# Altium project stm2f4discovery_K.PrjPcb
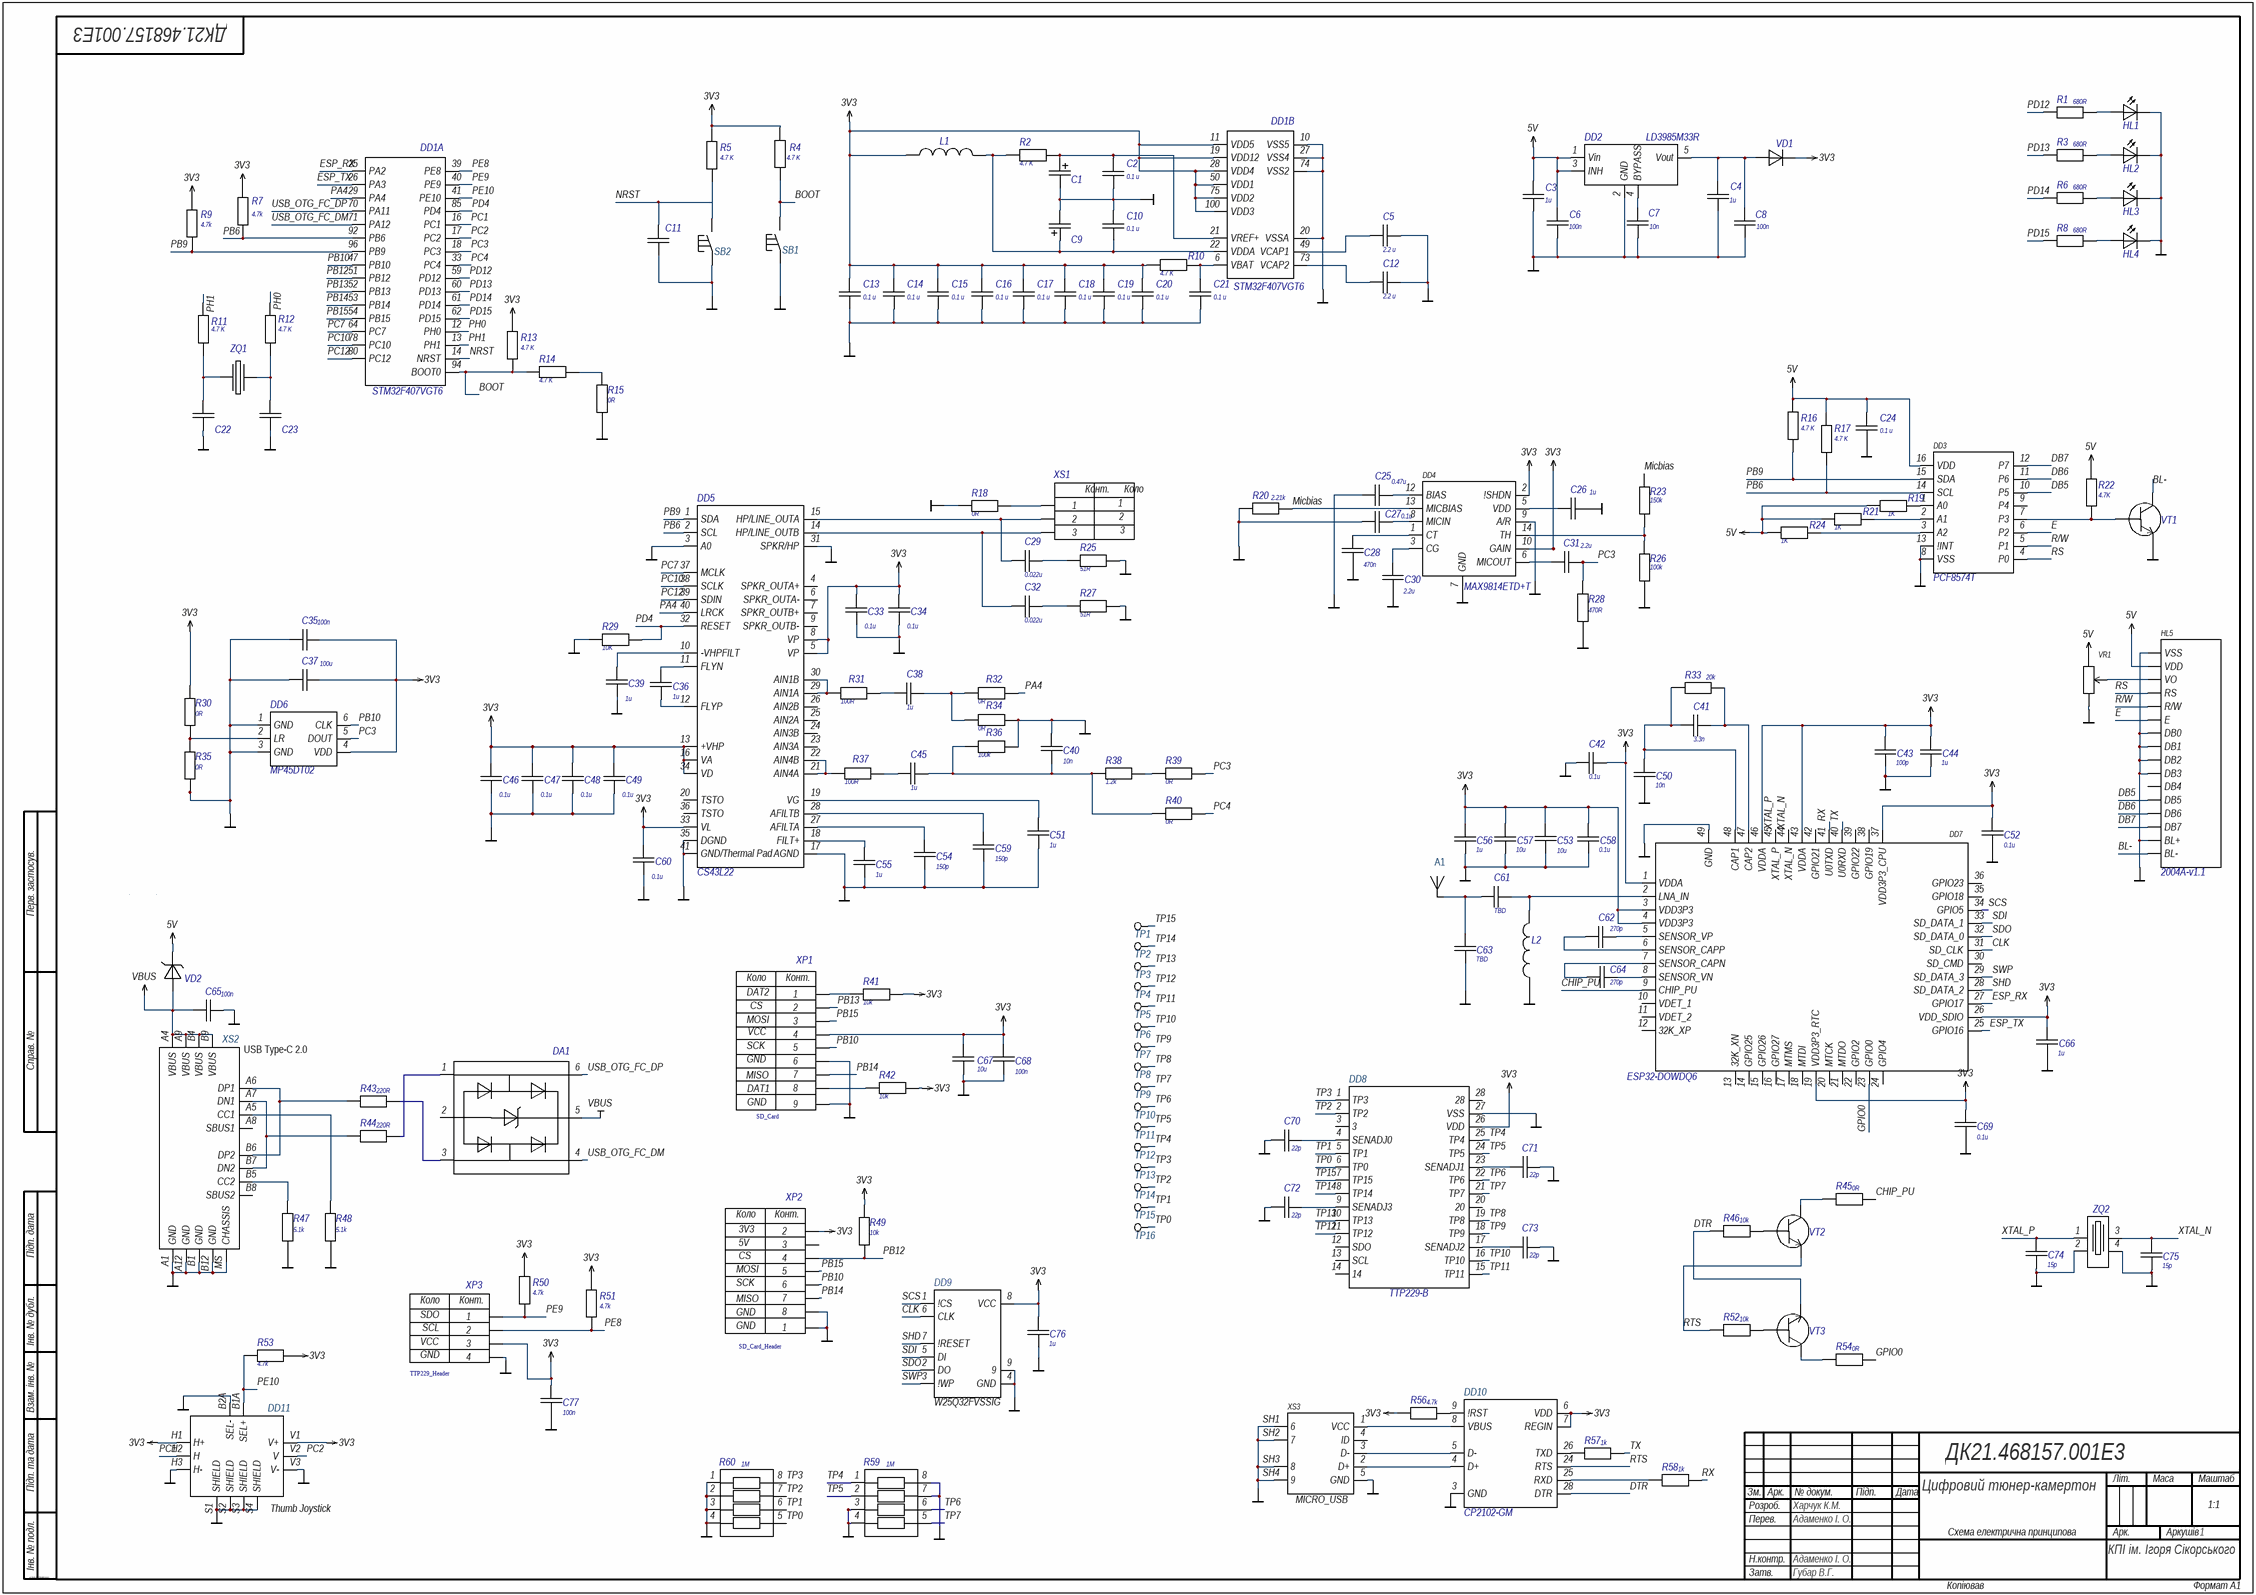
[diagram p0: ALL.SchDoc]
Вид_документа_SCH: Схема електрична принципова; Код_документа_SCH: Е3; Наименование: Цифровий тюнер-камертон; Наименование1: Цифровий тюнер-камертон; Наименование_PCB: Цифровий тюнер-камертон; Номер_документа_изменение: 1; Обозначение: ДК21.468157.001; Обозначение_PCB: ДК21.468157.001; Обозначение_Код: ДК21.468157.001Е3; Проект: ДК21.468157.001; Раздел: 1; Раздел_SCH: 1; Формат_PCB: А1; п_Н_контр: Адаменко І. О.; п_Н_контр_Р: Адаменко І. О.; п_Пров: Адаменко І. О.; п_Пров_Р: Адаменко І. О.; п_Разраб: Харчук К.М.; п_Разраб_Р: Харчук К.М.; п_Утв: Губар В.Г.; п_Утв_Р: Губар В.Г.
1 sheet, 188 parts. Net scope: global (net labels, ports and power ports of the same name join across sheets).
Board file: all.PcbDoc

## Sheet ALL.SchDoc
size 840 x 594 mm; Address1: L3, 12a Rodborough Rd; Address2: Frenchs Forest; Address3: NSW; Address4: Australia 2086; SheetTotal: 1

### Parts
A1  Antenna-1-Pin  [PCB_ANT]  (value not drawn)  (net tie)
C1  (no value)  [C_tantal]
C2  value 0.1 u  [C_0603]
C3  value 1u  [C_0603]
C4  value 1u  [C_0603]
C5  value 2.2 u  [C_0603]
C6  value 100n  [C_0603]
C7  value 10n  [C_0603]
C8  value 100n  [C_0603]
C9  (no value)  [C_tantal]
C10  value 0.1 u  [C_0603]
C11  (no value)  [C_0201]
C12  value 2.2 u  [C_0603]
C13  value 0.1 u  [C_0603]
C14  value 0.1 u  [C_0603]
C15  value 0.1 u  [C_0603]
C16  value 0.1 u  [C_0603]
C17  value 0.1 u  [C_0603]
C18  value 0.1 u  [C_0603]
C19  value 0.1 u  [C_0603]
C20  value 0.1 u  [C_0603]
C21  value 0.1 u  [C_0603]
C22  (no value)  [C_0603]
C23  (no value)  [C_0603]
C24  value 0.1 u  [C_0603]
C25  value 0.47u  [C_0603]
C26  value 1u  [C_0603]
C27  value 0.1u  [C_0603]
C28  value 470n  [C_0603]
C29  value 0.022u  [C_0603]
C30  value 2.2u  [C_0603]
C31  value 2.2u  [C_0603]
C32  value 0.022u  [C_0603]
C33  value 0.1u  [C_0603]
C34  value 0.1u  [C_0603]
C35  value 100n  [C_0603]
C36  value 1u  [C_0603]
C37  value 100u  [C_0603]
C38  value 1u  [C_0603]
C39  value 1u  [C_0603]
C40  value 10n  [C_0603]
C41  value 3.3n  [C_0603]
C42  value 0.1u  [C_0603]
C43  value 100p  [C_0603]
C44  value 1u  [C_0603]
C45  value 1u  [C_0603]
C46  value 0.1u  [C_0603]
C47  value 0.1u  [C_0603]
C48  value 0.1u  [C_0603]
C49  value 0.1u  [C_0603]
C50  value 10n  [C_0603]
C51  value 1u  [C_0603]
C52  value 0.1u  [C_0603]
C53  value 10u  [C_0603]
C54  value 150p  [C_0603]
C55  value 1u  [C_0603]
C56  value 1u  [C_0603]
C57  value 10u  [C_0603]
C58  value 0.1u  [C_0603]
C59  value 150p  [C_0603]
C60  value 0.1u  [C_0603]
C61  value TBD  [C_0603]
C62  value 270p  [C_0603]
C63  value TBD  [C_0603]
C64  value 270p  [C_0603]
C65  value 100n  [C_0603]
C66  value 1u  [C_0603]
C67  value 10u  [C_0603]
C68  value 100n  [C_0603]
C69  value 0.1u  [C_0603]
C70  value 22p  [C_0603]
C71  value 22p  [C_0603]
C72  value 22p  [C_0603]
C73  value 22p  [C_0603]
C74  value 15p  [C_0603]
C75  value 15p  [C_0603]
C76  value 1u  [C_0603]
C77  value 100n  [C_0603]
DA1  (no value)  [SOT-23-6L]
DD1  (no value)  [STM32F407VGT6]  (parts A,B of 2)
DD2  (no value)  [LD3985M33R]
DD3  Name: PCF8574T  [PCF8574TS]  (hidden comment: PCF8574T NXP USA Inc.)
DD4  Name: MAX9814ETD+T  [MAX9814]  (hidden comment: MAX9814ETD+T Analog Devices Inc./Maxim Integrated)
DD5  (no value)  [CS43L22]
DD6  (no value)  [MP45DT02]
DD7  ESP32-DOWDQ6 *  [ESP]  (value not drawn)
DD8  CP2102-GM  [28-SSOP]  (value not drawn)
DD9  W25Q32FVSSIG  [W25QxxxJVEIQ-127P800X80_MED]
DD10  CP2102-GM  [QFN-28_5x5mm]
DD11  Thumb Joystick  [XDCR_COM-09032]
HL1  (no value)  [LED]
HL2  (no value)  [LED]
HL3  (no value)  [LED]
HL4  (no value)  [LED]
HL5  Name: 2004A-v1.1  [lcd]  (hidden comment: LCD)
L1  (no value)  [INDUCTION]
L2  (no value)  [FB0603]
R1  value 680R  [R0_0603]  (hidden comment: 0603 0 В 680R 1% Keystone Electronics)
R2  value 4.7 K  [R0_0603]  (hidden comment: 0603 В 4.7 K 1% Keystone Electronics)
R3  value 680R  [R0_0603]  (hidden comment: 0603 0 В 680R 1% Keystone Electronics)
R4  value 4.7 K  [R0_0603]  (hidden comment: 0603 В 4.7 K 1% Keystone Electronics)
R5  value 4.7 K  [R0_0603]  (hidden comment: 0603 В 4.7 K 1% Keystone Electronics)
R6  value 680R  [R0_0603]  (hidden comment: 0603 0 В 680R 1% Keystone Electronics)
R7  value 4.7k  [R0_0603]  (hidden comment: 0603 0 В 4.7k 1% Keystone Electronics)
R8  value 680R  [R0_0603]  (hidden comment: 0603 0 В 680R 1% Keystone Electronics)
R9  value 4.7k  [R0_0603]  (hidden comment: 0603 0 В 4.7k 1% Keystone Electronics)
R10  value 4.7 K  [R0_0603]  (hidden comment: 0603 В 4.7 K 1% Keystone Electronics)
R11  value 4.7 K  [R0_0603]  (hidden comment: 0603 В 4.7 K 1% Keystone Electronics)
R12  value 4.7 K  [R0_0603]  (hidden comment: 0603 В 4.7 K 1% Keystone Electronics)
R13  value 4.7 K  [R0_0603]  (hidden comment: 0603 В 4.7 K 1% Keystone Electronics)
R14  value 4.7 K  [R0_0603]  (hidden comment: 0603 В 4.7 K 1% Keystone Electronics)
R15  value 0R  [R0_0603]  (hidden comment: 0603 В 0R 1% Keystone Electronics)
R16  value 4.7 K  [R0_0603]  (hidden comment: 0603 В 4.7 K 1% Keystone Electronics)
R17  value 4.7 K  [R0_0603]  (hidden comment: 0603 В 4.7 K 1% Keystone Electronics)
R18  value 0R  [R0_0603]  (hidden comment: 0603 В 0R 1% Keystone Electronics)
R19  value 1K  [R0_0603]  (hidden comment: 0603 В 1K 1% Keystone Electronics)
R20  value 2.21k  [R0_0603]  (hidden comment: 0603 0 В 2.21k 1% Keystone Electronics)
R21  value 1K  [R0_0603]  (hidden comment: 0603 В 1K 1% Keystone Electronics)
R22  value 4.7K  [R0_0603]  (hidden comment: 0603 В 4.7K 1% Keystone Electronics)
R23  value 150k  [R0_0603]  (hidden comment: 0603 0 В 150k 1% Keystone Electronics)
R24  value 1K  [R0_0603]  (hidden comment: 0603 В 1K 1% Keystone Electronics)
R25  value 51R  [R0_0603]  (hidden comment: 0603 В 51R 1% Keystone Electronics)
R26  value 100k  [R0_0603]  (hidden comment: 0603 0 В 100k 1% Keystone Electronics)
R27  value 51R  [R0_0603]  (hidden comment: 0603 В 51R 1% Keystone Electronics)
R28  value 470R  [R0_0603]  (hidden comment: 0603 0 В 470R 1% Keystone Electronics)
R29  value 10K  [R0_0603]  (hidden comment: 0603 В 10K 1% Keystone Electronics)
R30  value 0R  [R0_0603]  (hidden comment: 0603 В 0R 1% Keystone Electronics)
R31  value 100R  [R0_0603]  (hidden comment: 0603 В 100R 1% Keystone Electronics)
R32  value 0R  [R0_0603]  (hidden comment: 0603 В 0R 1% Keystone Electronics)
R33  value 20k  [R0_0603]  (hidden comment: 0603 0 В 20k 1% Keystone Electronics)
R34  value 0R  [R0_0603]  (hidden comment: 0603 В 0R 1% Keystone Electronics)
R35  value 0R  [R0_0603]  (hidden comment: 0603 В 0R 1% Keystone Electronics)
R36  value 100k  [R0_0603]  (hidden comment: 0603 В 100k 1% Keystone Electronics)
R37  value 100R  [R0_0603]  (hidden comment: 0603 В 100R 1% Keystone Electronics)
R38  value 1.2k  [R0_0603]  (hidden comment: 0603 В 1.2k 1% Keystone Electronics)
R39  value 0R  [R0_0603]  (hidden comment: 0603 В 0R 1% Keystone Electronics)
R40  value 0R  [R0_0603]  (hidden comment: 0603 В 0R 1% Keystone Electronics)
R41  value 10k  [R0_0603]  (hidden comment: 0603 0 В 10k 1% Keystone Electronics)
R42  value 10k  [R0_0603]  (hidden comment: 0603 0 В 10k 1% Keystone Electronics)
R43  value 220R  [R0_0603]  (hidden comment: 0603 0 В 220R 1% Keystone Electronics)
R44  value 220R  [R0_0603]  (hidden comment: 0603 0 В 220R 1% Keystone Electronics)
R45  value 0R  [R0_0603]  (hidden comment: 0603 0 В 0R 1% Keystone Electronics)
R46  value 10k  [R0_0603]  (hidden comment: 0603 0 В 10k 1% Keystone Electronics)
R47  value 5.1k  [R0_0603]  (hidden comment: 0603 0 В 5.1k 1% Keystone Electronics)
R48  value 5.1k  [R0_0603]  (hidden comment: 0603 0 В 5.1k 1% Keystone Electronics)
R49  value 10k  [R0_0603]  (hidden comment: 0603 0 В 10k 1% Keystone Electronics)
R50  value 4.7k  [R0_0603]  (hidden comment: 0603 0 В 4.7k 1% Keystone Electronics)
R51  value 4.7k  [R0_0603]  (hidden comment: 0603 0 В 4.7k 1% Keystone Electronics)
R52  value 10k  [R0_0603]  (hidden comment: 0603 0 В 10k 1% Keystone Electronics)
R53  value 4.7k  [R0_0603]  (hidden comment: 0603 0 В 4.7k 1% Keystone Electronics)
R54  value 0R  [R0_0603]  (hidden comment: 0603 0 В 0R 1% Keystone Electronics)
R56  value 4.7k  [R0_0603]  (hidden comment: 0603 0 В 4.7k 1% Keystone Electronics)
R57  value 1k  [R0_0603]  (hidden comment: 0603 0 В 1k 1% Keystone Electronics)
R58  value 1k  [R0_0603]  (hidden comment: 0603 0 В 1k 1% Keystone Electronics)
R59  value 1M  [RESISTOR_NETWORKS]  (hidden comment: 0603 0 В 1M 1% Keystone Electronics)
R60  value 1M  [RESISTOR_NETWORKS]  (hidden comment: 0603 0 В 1M 1% Keystone Electronics)
SB1  (no value)  [button2]
SB2  (no value)  [button2]
TP1  TP  [PAD-1.25mm]  (value not drawn)  (no BOM)
TP2  TP  [PAD-1.25mm]  (value not drawn)  (no BOM)
TP3  TP  [PAD-1.25mm]  (value not drawn)  (no BOM)
TP4  TP  [PAD-1.25mm]  (value not drawn)  (no BOM)
TP5  TP  [PAD-1.25mm]  (value not drawn)  (no BOM)
TP6  TP  [PAD-1.25mm]  (value not drawn)  (no BOM)
TP7  TP  [PAD-1.25mm]  (value not drawn)  (no BOM)
TP8  TP  [PAD-1.25mm]  (value not drawn)  (no BOM)
TP9  TP  [PAD-1.25mm]  (value not drawn)  (no BOM)
TP10  TP  [PAD-1.25mm]  (value not drawn)  (no BOM)
TP11  TP  [PAD-1.25mm]  (value not drawn)  (no BOM)
TP12  TP  [PAD-1.25mm]  (value not drawn)  (no BOM)
TP13  TP  [PAD-1.25mm]  (value not drawn)  (no BOM)
TP14  TP  [PAD-1.25mm]  (value not drawn)  (no BOM)
TP15  TP  [PAD-1.25mm]  (value not drawn)  (no BOM)
TP16  TP  [PAD-1.25mm]  (value not drawn)  (no BOM)
VD1  (no value)  [BAT60JFILM]
VD2  (no value)  [BAT60JFILM]
VR1  RHEOSTAT  [RHEOSTAT]  (value not drawn)
VT1  (no value)  [SOT-23]
VT2  (no value)  [SOT-23]
VT3  (no value)  [SOT-23]
XP1  SD_Card  [sd_card]
XP2  SD_Card_Header  [xp8]
XP3  TTP229_Header  [XP4_ttp229]
XS1  SJ1-2503A Same Sky (Formerly CUI Devices)  [XS_AUDIO]  (value not drawn)
XS2  USB Type-C 2.0  [SAMESKY_UJ20-C-H-G-SMT-1-P16-TR]
XS3  MICRO_USB  [MICRO_USB]
ZQ1  (no value)  [Oscillator]
ZQ2  (no value)  [crystal]

### Nets
3V3: C13.2 C14.2 C15.2 C16.2 C17.2 C18.2 C19.2 C20.2 C33.2 C34.2 C35.2 C37.2 C42.1 C43.2 C44.2 C46.2 C47.2 C48.2 C49.2 C52.1 C53.1 C56.2 C57.2 C58.2 C60.2 C66.2 C67.2 C68.2 C69.1 C76.2 C77.1 DD1.11(VDD5) DD1.19(VDD12) DD1.28(VDD4) DD1.50(VDD1) DD1.75(VDD2) DD1.100(VDD3) DD4.2(!SHDN) DD4.10(GAIN) DD5.5(VP) DD5.8(VP) DD5.13(+VHP) DD5.16(VA) DD5.33(VL) DD5.34(VD) DD6.4(VDD) DD7.1(VDDA) DD7.3(VDD3P3) DD7.4(VDD3P3) DD7.19(VDD3P3_RTC) DD7.26(VDD_SDIO) DD7.37(VDD3P3_CPU) DD7.43(VDDA) DD7.46(VDDA) DD8.26(VDD) DD9.8(VCC) DD10.6(VDD) DD10.7(REGIN) DD11.H1(H+) DD11.V1(V+) L1.1 R4.2 R5.2 R7.2 R9.2 R10.2 R13.2 R30.1 R41.2 R42.2 R49.2 R50.2 R51.2 R53.2 R56.1 VD1.2 XP1.4 XP2.2 XP3.3
5V: C3.2 C6.2 C24.2 DD2.1(Vin) DD2.3(INH) DD3.16(VDD) HL5.2(VDD) R16.2 R17.2 R19.2 R21.2 R22.2 R24.2 VD2.2 VR1.1
GND: C1.2 C2.1 C3.1 C4.1 C5.1 C6.1 C7.1 C8.1 C9.2 C10.2 C11.1 C12.1 C13.1 C14.1 C15.1 C16.1 C17.1 C18.1 C19.1 C20.1 C21.1 C22.2 C23.2 C24.1 C25.2 C26.2 C27.2 C28.2 C30.2 C33.1 C34.1 C35.1 C37.1 C39.1 C40.1 C42.2 C43.1 C44.1 C46.1 C47.1 C48.1 C49.1 C50.1 C51.2 C52.2 C53.2 C54.2 C55.2 C56.1 C57.1 C58.1 C59.1 C60.1 C63.1 C65.2 C66.1 C67.1 C68.1 C69.2 C70.1 C71.2 C72.1 C73.2 C74.1 C75.1 C76.1 C77.2 DD1.10(VSS5) DD1.20(VSSA) DD1.27(VSS4) DD1.74(VSS2) DD2.2(GND) DD3.8(VSS) DD3.13(!INT) DD4.7(GND) DD4.9(A/R) DD5.3(A0) DD5.17(AGND) DD5.31(SPKR/HP) DD5.35(DGND) DD5.41(GND/Thermal_Pad) DD6.1(GND) DD6.3(GND) DD7.49(GND) DD8.27(VSS) DD9.4(GND) DD9.9 DD10.3(GND) DD11.B2A(SEL-) DD11.H3(H-) DD11.S1(SHIELD) DD11.S2(SHIELD) DD11.S3(SHIELD) DD11.S4(SHIELD) DD11.V3(V-) HL1.2 HL2.2 HL3.2 HL4.2 HL5.1(VSS) HL5.7(DB0) HL5.8(DB1) HL5.9(DB2) HL5.10(DB3) HL5.15(BL+) L2.1 R15.2 R18.1 R20.1 R25.2 R26.1 R27.2 R28.1 R29.2 R34.2 R35.2 R36.2 R47.1 R48.1 R59.3 R59.4 R59.7 R59.8 R60.1 R60.2 R60.3 R60.4 SB1.1 SB2.1 VR1.2 VT1.2 XP1.6 XP1.9 XP2.1 XP2.8 XP3.4 XS2.A1(GND) XS2.A12(GND) XS2.B1(GND) XS2.B12(GND) XS2.MS(CHASSIS) XS3.5(GND) XS3.SH1(6) XS3.SH2(7) XS3.SH3(8) XS3.SH4(9) ZQ2.2 ZQ2.4
VBUS: C65.1 DA1.5 VD2.1 XS2.A4(VBUS) XS2.A9(VBUS) XS2.B4(VBUS) XS2.B9(VBUS)
BL-: HL5.16(BL-) VT1.1
BOOT: DD1.94(BOOT0) R4.1 R13.1 R14.2 SB1.2
CHIP_PU: DD7.9(CHIP_PU) R45.2
CLK: DD7.31(SD_CLK) DD9.6(CLK)
DB5: DD3.10(P5) HL5.12(DB5)
DB6: DD3.11(P6) HL5.13(DB6)
DB7: DD3.12(P7) HL5.14(DB7)
DTR: DD10.28(DTR) R46.1 VT3.2
E: DD3.6(P2) HL5.6(E)
ESP_RX: DD1.25(PA2) DD7.27(GPIO17)
ESP_TX: DD1.26(PA3) DD7.25(GPIO16)
GPIO0: DD7.23(GPIO0) R54.2
Micbias: DD4.13(MICBIAS) R20.2 R23.2
NRST: C11.2 DD1.14(NRST) R5.1 SB2.2
PA4: DD1.29(PA4) DD5.40(LRCK) R32.2
PB6: DD1.92(PB6) DD3.14(SCL) DD5.2(SCL) R7.1 R17.1
PB9: DD1.96(PB9) DD3.15(SDA) DD5.1(SDA) R9.1 R16.1
PB10: DD1.47(PB10) DD6.6(CLK) XP1.5 XP2.6
PB12: DD1.51(PB12) R49.1 XP2.4
PB13: DD1.52(PB13) XP1.2
PB14: DD1.53(PB14) XP1.7 XP2.7
PB15: DD1.54(PB15) XP1.3 XP2.5
PC1: DD1.16(PC1) DD11.H2(H)
PC2: DD1.17(PC2) DD11.V2(V)
PC3: C31.2 DD1.18(PC3) DD6.5(DOUT) R28.2 R39.2
PC4: DD1.33(PC4) R40.2
PC7: DD1.64(PC7) DD5.37(MCLK)
PC10: DD1.78(PC10) DD5.38(SCLK)
PC12: DD1.80(PC12) DD5.39(SDIN)
PD4: DD1.85(PD4) DD5.32(RESET) R29.1
PD12: DD1.59(PD12) R1.1
PD13: DD1.60(PD13) R3.1
PD14: DD1.61(PD14) R6.1
PD15: DD1.62(PD15) R8.1
PE8: DD1.39(PE8) R51.1 XP3.2
PE9: DD1.40(PE9) R50.1 XP3.1
PE10: DD1.41(PE10) DD11.B1A(SEL+) R53.1
PH0: DD1.12(PH0) R12.2
PH1: DD1.13(PH1) R11.2
R/W: DD3.5(P1) HL5.5(R/W)
RS: DD3.4(P0) HL5.4(RS)
RTS: DD10.24(RTS) R52.1 VT2.2
RX: DD7.41(U0TXD) R58.2
SCS: DD7.34(GPIO5) DD9.1(!CS)
SDI: DD7.33(SD_DATA_1) DD9.5(DI)
SDO: DD7.32(SD_DATA_0) DD9.2(DO)
SHD: DD7.28(SD_DATA_2) DD9.7(!RESET)
SWP: DD7.29(SD_DATA_3) DD9.3(!WP)
TP0: DD8.6(TP0) R60.5 TP16.1
TP1: DD8.5(TP1) R60.6 TP15.1
TP2: DD8.2(TP2) R60.7 TP14.1
TP3: DD8.1(TP3) R60.8 TP13.1
TP4: DD8.25(TP4) R59.1 TP12.1
TP5: DD8.24(TP5) R59.2 TP11.1
TP6: DD8.22(TP6) R59.6 TP10.1
TP7: DD8.21(TP7) R59.5 TP9.1
TP8: DD8.19(TP8) TP8.1
TP9: DD8.18(TP9) TP7.1
TP10: DD8.16(TP10) TP6.1
TP11: DD8.15(TP11) TP5.1
TP12: DD8.11(TP12) TP4.1
TP13: DD8.10(TP13) TP3.1
TP14: DD8.8(TP14) TP2.1
TP15: DD8.7(TP15) TP1.1
TX: DD7.40(U0RXD) R57.2
USB_OTG_FC_DM: DA1.4 DD1.71(PA12)
USB_OTG_FC_DP: DA1.6 DD1.70(PA11)
XTAL_N: C75.2 DD7.44(XTAL_N) ZQ2.3
XTAL_P: C74.2 DD7.45(XTAL_P) ZQ2.1
NetA1_1: A1.1 C61.2 C63.2
NetC1_1: C1.1 C2.2 DD1.21(VREF+) R2.1
NetC4_2: C4.2 C8.2 DD2.5(Vout) VD1.1
NetC5_2: C5.2 DD1.49(VCAP1)
NetC7_2: C7.2 DD2.4(BYPASS)
NetC9_1: C9.1 C10.1 DD1.22(VDDA) L1.2 R2.2
NetC12_2: C12.2 DD1.73(VCAP2)
NetC21_2: C21.2 DD1.6(VBAT) R10.1
NetC22_1: C22.1 R11.1 ZQ1.1
NetC23_1: C23.1 R12.1 ZQ1.2
NetC25_1: C25.1 DD4.12(BIAS)
NetC26_1: C26.1 DD4.5(VDD)
NetC27_1: C27.1 DD4.8(MICIN)
NetC28_1: C28.1 DD4.1(CT)
NetC29_1: C29.1 DD5.15(HP/LINE_OUTA) XS1.2
NetC29_2: C29.2 R25.1
NetC30_1: C30.1 DD4.3(CG)
NetC31_1: C31.1 DD4.6(MICOUT)
NetC32_1: C32.1 DD5.14(HP/LINE_OUTB) XS1.3
NetC32_2: C32.2 R27.1
NetC36_1: C36.1 DD5.11(FLYN)
NetC36_2: C36.2 DD5.12(FLYP)
NetC38_1: C38.1 R32.1 R34.1
NetC38_2: C38.2 R31.2
NetC39_2: C39.2 DD5.10(-VHPFILT)
NetC40_2: C40.2 C45.1 R36.1 R38.1 R40.1
NetC41_1: C41.1 DD7.47(CAP2) R33.2
NetC41_2: C41.2 C50.2 DD7.48(CAP1) R33.1
NetC45_2: C45.2 R37.2
NetC51_1: C51.1 DD5.19(VG)
NetC54_1: C54.1 DD5.27(AFILTA)
NetC55_1: C55.1 DD5.18(FILT+)
NetC59_2: C59.2 DD5.28(AFILTB)
NetC61_1: C61.1 DD7.2(LNA_IN) L2.2
NetC62_1: C62.1 DD7.5(SENSOR_VP)
NetC62_2: C62.2 DD7.6(SENSOR_CAPP)
NetC64_1: C64.1 DD7.8(SENSOR_VN)
NetC64_2: C64.2 DD7.7(SENSOR_CAPN)
NetC70_2: C70.2 DD8.4(SENADJ0)
NetC71_1: C71.1 DD8.23(SENADJ1)
NetC72_2: C72.2 DD8.9(SENADJ3)
NetC73_1: C73.1 DD8.17(SENADJ2)
NetDA1_1: DA1.1 R44.1
NetDA1_3: DA1.3 R43.1
NetDD3_1: DD3.1(A0) R19.1
NetDD3_2: DD3.2(A1) R21.1
NetDD3_3: DD3.3(A2) R24.1
NetDD3_7: DD3.7(P3) R22.1 VT1.3
NetDD4_14: DD4.14(TH) R23.1 R26.2
NetDD5_21: DD5.21(AIN4A) DD5.22(AIN4B) R37.1
NetDD5_29: DD5.29(AIN1A) DD5.30(AIN1B) R31.1
NetDD6_2: DD6.2(LR) R30.2 R35.1
NetDD10_4: DD10.4(D+) XS3.2(D+)
NetDD10_5: DD10.5(D-) XS3.3(D-)
NetDD10_8: DD10.8(VBUS) XS3.1(VCC)
NetDD10_9: DD10.9(!RST) R56.2
NetDD10_25: DD10.25(RXD) R58.1
NetDD10_26: DD10.26(TXD) R57.1
NetHL1_1: HL1.1 R1.2
NetHL2_1: HL2.1 R3.2
NetHL3_1: HL3.1 R6.2
NetHL4_1: HL4.1 R8.2
NetHL5_3: HL5.3(VO) VR1.3
NetR14_1: R14.1 R15.1
NetR18_2: R18.2 XS1.1
NetR38_2: R38.2 R39.1
NetR41_1: R41.1 XP1.1
NetR42_1: R42.1 XP1.8
NetR43_2: R43.2 XS2.A6(DP1) XS2.B6(DP2)
NetR44_2: R44.2 XS2.A7(DN1) XS2.B7(DN2)
NetR45_1: R45.1 VT2.1
NetR46_2: R46.2 VT2.3
NetR47_2: R47.2 XS2.B5(CC2)
NetR48_2: R48.2 XS2.A5(CC1)
NetR52_2: R52.2 VT3.3
NetR54_1: R54.1 VT3.1

Not connected (* = marked no-connect by the designer): DA1 2; DD3 9(P4); DD5 4(SPKR_OUTA+) 6(SPKR_OUTA-) 7(SPKR_OUTB+) 9(SPKR_OUTB-) 20(TSTO) 23(AIN3A) 24(AIN3B) 25(AIN2A) 26(AIN2B) 36(TSTO); DD7 10(VDET_1) 11(VDET_2) 12(32K_XP) 13(32K_XN) 14(GPIO25) 15(GPIO26) 16(GPIO27) 17(MTMS) 18(MTDI) 20(MTCK) 21(MTDO) 22(GPIO2) 24(GPIO4) 30(SD_CMD) 35(GPIO18) 36(GPIO23) 38(GPIO19) 39(GPIO22) 42(GPIO21); DD8 3 12(SDO) 13(SCL) 14 20 28; HL5 11(DB4); XP2 3; XS2 A8(SBUS1) B8(SBUS2); XS3 4(ID)

### Notes on the sheet
- 1:1
- Перв. застосув.
- Справ. №
- Підп. дата
- Інв. № дубл.
- Взам. інв. №
- Підп. та дата
- Зм.
- Розроб.
- Арк.
- № докум.
- Підп.
- Дата
- Літ.
- Маса
- Маштаб
- Перев.
- Аркушів
- Інв. № подл.
- Н.контр.
- Затв.
- КПІ ім. Ігоря Сікорського
- ALTIUM GOSTBOM2.0 KEV
- Копіював
- Формат А1
- (in symbol 4_PIN_HEADER_SDO) Коло; Конт.; SDO; SCL; VCC; GND
- (in symbol 8_PIN_HEADER) Коло; Конт.; 3V3; 5V; CS; MOSI; SCK; MISO; GND
- (in symbol 9_PIN_HEADER) Коло; Конт.; DAT2; CS; MOSI; VCC; SCK; GND; MISO; DAT1
- (in symbol JACK) Конт.; Коло

### Library data of the parts
A1 = Antenna-1-Pin: SMA, Through-Hole
C1 C9 = С-1u_tantal: Manufacturer: KEMET; Voltage: 20 В; Tolerance: 10%; Value: 1 мкФ; Temp_Coef: -; Package: 1206
C2-C8 C10 C12-C21 C24-C77 = C_0603: Manufacturer: TDK Corporation; Temp_Coef: X7R; Voltage: 50 В; Tolerance: 10%; Package: 0603
C11 = С-0.1u: Manufacturer: Murata Electronics; Temp_Coef: X7R; Voltage: 16 В; Tolerance: 10%; Value: 0.1 мкФ; Package: 0201
C22 C23 = С-20p: Manufacturer: KEMET; Temp_Coef: C0G, NP0; Voltage: 250 В; Tolerance: 0.1%; Value: 20 пкФ; Package: 0603
DA1 = USBLC6-2SC6: 17V Clamp 5A (8/20Âµs) Ipp Tvs Diode Surface Mount, SOT-23-6; Manufacturer: STMicroelectronics; Name: USBLC6-2SC6
DD1 = STM32F407VGT6_SHORT: Manufacturer: STMicroelectronics; Name: STM32F407VGT6
DD2 = LD3985M33R: Manufacturer: STMicroelectronics; Name: LD3985M33R
DD3 = PCF8574TS: Manufacturer: NXP USA Inc.
DD4 = MAX9814: Manufacturer: Analog Devices Inc./Maxim Integrated
DD5 = CS43L22: Manufaturer: Cirrus Logic Inc.; Name: CS43L22
DD6 = MP45DT02: Manufacturer: STMicroelectronics; Name: MP45DT02
DD7 = ESP32-DOWDQ6: Name: ESP32-DOWDQ6; Manufacturer: *
DD8 = TTP229-B: Manufacturer: Tontek Design Technology; Package: 28-SSOP; Part Number: TTP229-B
DD9 = W25Q256JVEI1: FLASH - NOR Memory IC 256Mb SPI - Quad I/O, QPI 133 MHz 8-WSON; Manufacturer: Winbond Electronics; Package: SOIC-8; Part Number: W25Q32FVSSIG
DD10 = CP2102-GM: USB 2.0 to UART, 28-QFN (5x5); Manufacturer: Silicon Labs; Package: QFN-28 Silicon Labs; Part Number: CP2102-GM
DD11 = COM-09032: Thumb Joystick, 1568-09032-ND; Manufacturer: SparkFun Electronics; Availability: Unavailable; Part Number: COM-09032
HL1-HL4 = LED: Manufacturer: Cree LED; Name: XPEBFR-LS-0000-00A01
HL5 = LCD: Manufacturer: Shenzhen Eone Electronics
L1 L2 = induction: Manufacturer: TAI-TECH Advanced Electronics Co., Ltd.; Name: FCM 1608KF-601T03
R1 R3 R6-R9 R20 R23 R26 R28 R33 R41-R54 R56-R58 = R_0603: Power: 0 В; Package: 0603; Tolerance: 1%; Manufacturer: Keystone Electronics
R2 R4 R5 R10-R19 R21 R22 R24 R25 R27 R29-R32 R34-R40 = R_0603: Package: 0603; Power: В; Tolerance: 1%; Manufacturer: Keystone Electronics
R59 R60 = RESISTOR_NETWORKS: Power: 0 В; Package: 0603; Tolerance: 1%; Manufacturer: Keystone Electronics
SB1 SB2 = button2: Manufacturer: Würth Elektronik; Name: 430182043816
TP1-TP16 = TP: Test point 1.25mm. THT
VD1 = BAT60JFILM: Manufacturer: STMicroelectronics; Name: BAT60JFILM
VD2 = DIODE_SCHOTTKY: Manufacturer: STMicroelectronics
VR1 = RHEOSTAT: Manufacturer: Bourns Inc.; Name: 3313J-1-103E
VT1-VT3 = NPN: Manufacturer: onsemi; Name: MMBTA06LT1G
XP1 = 9_PIN_HEADER: Manufacturer: Samtec Inc.; Name: TS-111-T-AA
XP2 = 8_PIN_HEADER: Manufacturer: Samtec Inc.; Name: TS-111-T-AA
XP3 = 4_PIN_HEADER_SDO: CN3; Manufacturer: Samtec Inc.; Name: TS-104-T-A
XS1 = JACK: Name: SJ1-2503A; Manufacturer: Same Sky (Formerly CUI Devices)
XS2 = USB Type-C 2.0: Conn USB 2.0 Type C RCP 16 POS 0.85mm Solder RA Thru-Hole 16 Terminal 1 Port T/R; pin to pad: A1>B1_A12 A4>A4_B9 A9>B4_A9 A12>A1_B12 B1>A1_B12 B4>B4_A9 B9>A4_B9 B12>B1_A12; Manufacturer: Same Sky; Part Number: UJ20-C-H-G-SMT-TR
XS3 = MICRO_USB: Manufacturer: Amphenol ICC (FCI); Name: 10104110-0001LF
ZQ1 = Oscillator: Manufacturer: ECS Inc.; Name: ECS-2520MV-080-CN-TR
ZQ2 = CRYSTAL: Manufacturer: NDK (NIHON DEMPA KOGYO CO., LTD); Name: STDCZS3-40M